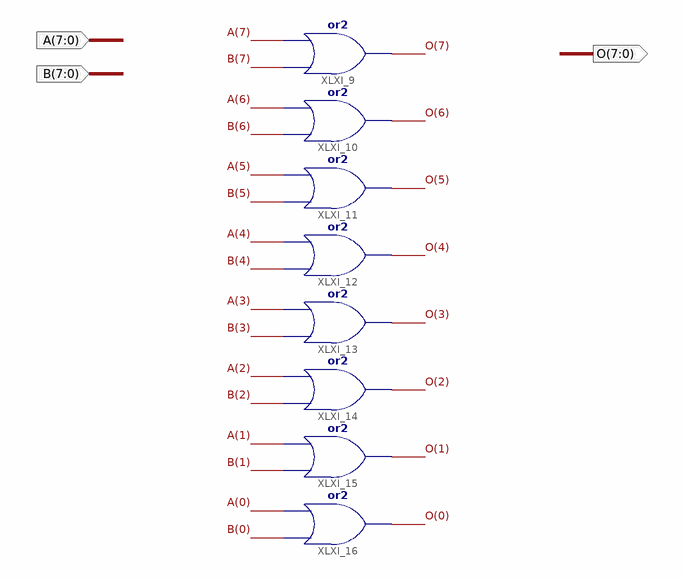
[diagram p0: schematic sheet 1]
// Xilinx ISE schematic bitOR.sch (spartan6) as structural Verilog: 8 symbols, 3 ports
module bitOR (
  input  [7:0] A,
  input  [7:0] B,
  output [7:0] O
);

  or XLXI_9 (O[7], B[7], A[7]);
  or XLXI_10 (O[6], B[6], A[6]);
  or XLXI_11 (O[5], B[5], A[5]);
  or XLXI_12 (O[4], B[4], A[4]);
  or XLXI_13 (O[3], B[3], A[3]);
  or XLXI_14 (O[2], B[2], A[2]);
  or XLXI_15 (O[1], B[1], A[1]);
  or XLXI_16 (O[0], B[0], A[0]);
endmodule
